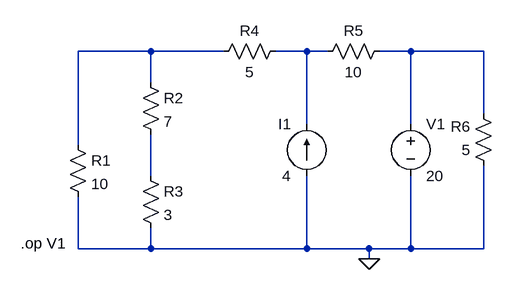
[diagram p0: schematic Draft2.asc]
Draft2.asc, the LTspice schematic file:
Version 4
SHEET 1 880 680
WIRE 256 192 144 192
WIRE 368 192 256 192
WIRE 496 192 448 192
WIRE 528 192 496 192
WIRE 656 192 608 192
WIRE 768 192 656 192
WIRE 256 240 256 192
WIRE 768 288 768 192
WIRE 496 304 496 192
WIRE 656 304 656 192
WIRE 144 336 144 192
WIRE 256 384 256 320
WIRE 144 496 144 416
WIRE 256 496 256 464
WIRE 256 496 144 496
WIRE 496 496 496 384
WIRE 496 496 256 496
WIRE 592 496 496 496
WIRE 656 496 656 384
WIRE 656 496 592 496
WIRE 768 496 768 368
WIRE 768 496 656 496
WIRE 592 512 592 496
FLAG 592 512 0
SYMBOL res 128 320 R0
SYMATTR InstName R1
SYMATTR Value 10
SYMBOL res 240 224 R0
SYMATTR InstName R2
SYMATTR Value 7
SYMBOL res 240 368 R0
SYMATTR InstName R3
SYMATTR Value 3
SYMBOL res 464 176 R90
WINDOW 0 0 56 VBottom 2
WINDOW 3 32 56 VTop 2
SYMATTR InstName R4
SYMATTR Value 5
SYMBOL res 624 176 R90
WINDOW 0 0 56 VBottom 2
WINDOW 3 32 56 VTop 2
SYMATTR InstName R5
SYMATTR Value 10
SYMBOL res 784 384 R180
WINDOW 0 36 76 Left 2
WINDOW 3 36 40 Left 2
SYMATTR InstName R6
SYMATTR Value 5
SYMBOL current 496 384 R180
WINDOW 0 24 80 Left 2
WINDOW 3 24 0 Left 2
SYMATTR InstName I1
SYMATTR Value 4
SYMBOL voltage 656 288 R0
SYMATTR InstName V1
SYMATTR Value 20
TEXT 56 488 Left 2 !.op V1

The netlist it stands for:
* Draft2.asc
R1 N001 0 10
R2 N001 N004 7
R3 N004 0 3
R4 N002 N001 5
R5 N003 N002 10
R6 0 N003 5
I1 0 N002 4
V1 N003 0 20
.op V1
.backanno
.end